# Altium schematic sheet Schematic原理图.schdoc
size 322 x 216 mm
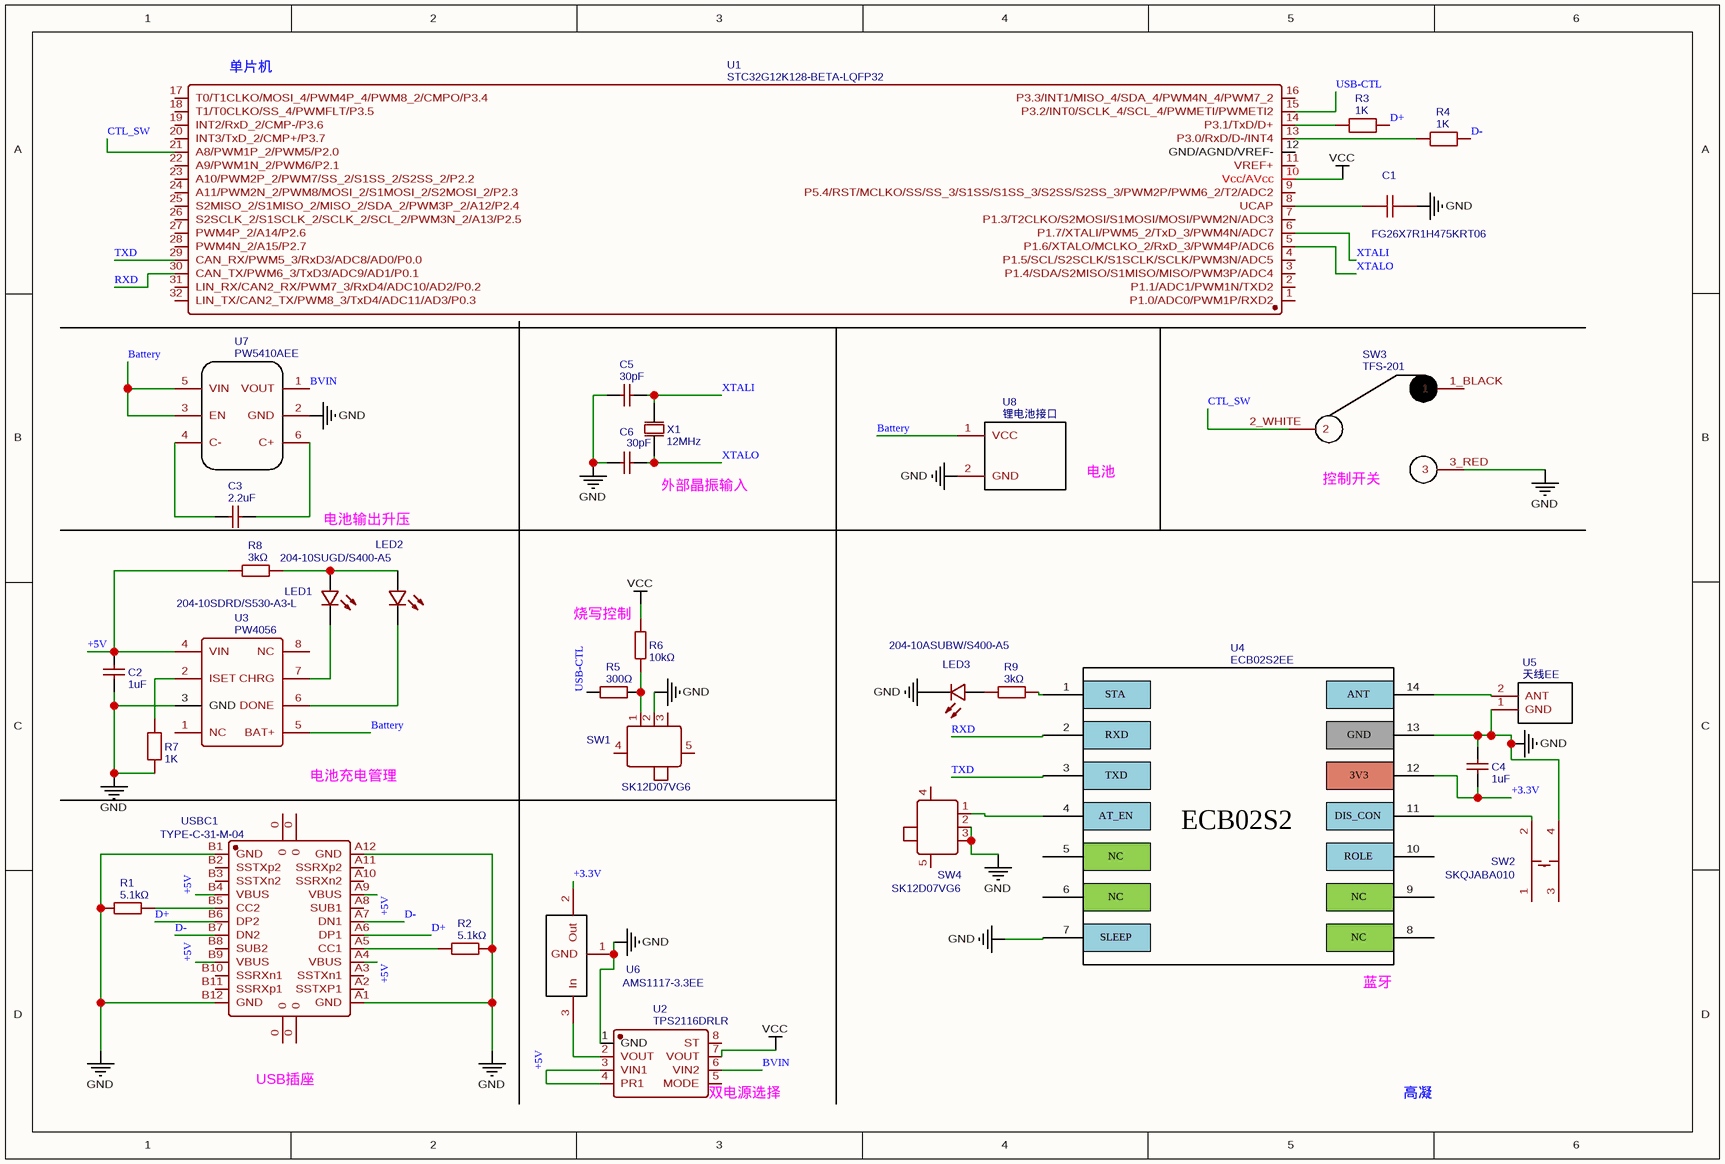
[diagram p0: Schematic原理图.schdoc]

## Parts
C1  FG26X7R1H475KRT06  [CAP-TH_L5.5-W3.5-P5.00-D0.5]
C2  1uF  [CAP-TH_L8.5-W5.0-P5.00-D1.2]
C3  2.2uF  [CAP-TH_L5.0-W2.5-P5.08-D0.7]
C4  1uF  [CAP-TH_L8.5-W5.0-P5.00-D1.2]
C5  30pF  [CAP-TH_L5.0-W2.5-P5.08-D0.7]
C6  30pF  [CAP-TH_L5.0-W2.5-P5.08-D0.7]
LED1  204-10SDRD/S530-A3-L  [LED-TH_BD3.8-P2.54-FD]
LED2  204-10SUGD/S400-A5  [LED-TH_BD3.0-P2.54-FD]
LED3  204-10ASUBW/S400-A5  [LED-TH_BD3.0-P2.54-FD]
R1  5.1kΩ  [RES-TH_BD2.2-L6.5-P10.50-D0.9]
R2  5.1kΩ  [RES-TH_BD2.2-L6.5-P10.50-D0.9]
R3  1K  [RES-TH_BD2.5-L6.5-P10.50-D0.6]
R4  1K  [RES-TH_BD2.5-L6.5-P10.50-D0.6]
R5  300Ω  [RES-TH_BD2.2-L6.5-P10.50-D0.6]
R6  10kΩ  [RES-TH_BD4.5-L11.0-P15.00-D0.7]
R7  1K  [RES-TH_BD2.5-L6.5-P10.50-D0.6]
R8  3kΩ  [RES-TH_BD2.2-L6.5-P10.50-D0.9]
R9  3kΩ  [RES-TH_BD2.2-L6.5-P10.50-D0.9]
SW1  SK12D07VG6  [SW-TH_SK12D07VG6]
SW2  SKQJABA010  [KEY-TH_4P-L6.2-W6.2-P4.50-LS6.5]
SW3  TFS-201  [TFS-201]
SW4  SK12D07VG6  [SW-TH_SK12D07VG6]
U1  STC32G12K128-BETA-LQFP32  [LQFP-32_L7.0-W7.0-P0.80-LS9.0-BL]
U2  TPS2116DRLR  [SOT-583-8_L2.1-W1.6-P0.50-LS1.6-BL]
U3  PW4056  [ESOP-8_L4.9-W3.9-P1.27-LS6.0-BL-EP2.6]
U4  ECB02S2EE  [ECB02S2]
U5  天线EE  [蓝牙天线]
U6  AMS1117-3.3EE  [AMS1117-SMALL]
U7  PW5410AEE  [PW5410A]
U8  锂电池接口  [电池接口]
USBC1  TYPE-C-31-M-04  [USB-C-SMD_TYPE-C-USB-20]
X1  12MHz  [HC-49US_L11.5-W4.5-P4.88]

## Nets
GND: C1.2 C2.1 C4.2 C5.1 C6.2 LED3.2(K) R1.1 R2.2 R7.1 SW1.2 SW2.4 SW3.3_RED(3) SW4.2 SW4.3 U2.1(GND) U3.3(GND) U4.7 U4.13 U5.1(GND) U6.1(GND) U7.2(GND) U8.2(GND) USBC1.A1(GND) USBC1.A12(GND) USBC1.B1(GND) USBC1.B12(GND)
VCC: R6.2 U1.10(Vcc/AVcc) U2.7(VOUT)
+3.3V: C4.1 U4.12 U6.2(Out)
+5V: C2.2 R8.1 U2.3(VIN1) U2.4(PR1) U3.4(VIN) USBC1.A4(VBUS) USBC1.A9(VBUS) USBC1.B4(VBUS) USBC1.B9(VBUS)
Battery: U3.5(BAT+) U7.3(EN) U7.5(VIN) U8.1(VCC)
BVIN: U2.6(VIN2) U7.1(VOUT)
CTL_SW: SW3.2_WHITE(2) U1.21(A8/PWM1P_2/PWM5/P2.0)
D+: R3.1 USBC1.A6(DP1) USBC1.B6(DP2)
D-: R4.1 USBC1.A7(DN1) USBC1.B7(DN2)
RXD: U1.30(CAN_TX/PWM6_3/TxD3/ADC9/AD1/P0.1) U4.2
TXD: U1.29(CAN_RX/PWM5_3/RxD3/ADC8/AD0/P0.0) U4.3
USB-CTL: R5.1 U1.15(P3.2/INT0/SCLK_4/SCL_4/PWMETI/PWMETI2)
XTALI: C5.2 U1.6(P1.7/XTALI/PWM5_2/TxD_3/PWM4N/ADC7) X1.2(OSC2)
XTALO: C6.1 U1.5(P1.6/XTALO/MCLKO_2/RxD_3/PWM4P/ADC6) X1.1(OSC1)
NetC1_1: C1.1 U1.8(UCAP)
NetC3_1: C3.1 U7.4(C-)
NetC3_2: C3.2 U7.6(C+)
NetLED1_1: LED1.1(A) LED2.1(A) R8.2
NetLED1_2: LED1.2(C) U3.7(CHRG)
NetLED2_2: LED2.2(K) U3.6(DONE)
NetLED3_1: LED3.1(A) R9.1
NetR1_2: R1.2 USBC1.B5(CC2)
NetR2_1: R2.1 USBC1.A5(CC1)
NetR3_2: R3.2 U1.14(P3.1/TxD/D+)
NetR4_2: R4.2 U1.13(P3.0/RxD/D-/INT4)
NetR5_2: R5.2 R6.1 SW1.1
NetR7_2: R7.2 U3.2(ISET)
NetR9_2: R9.2 U4.1
NetSW2_2: SW2.2 U4.11
NetSW4_1: SW4.1 U4.4
NetU2_2: U2.2(VOUT) U6.3(In)
NetU4_14: U4.14 U5.2(ANT)

Not connected (* = marked no-connect by the designer): SW1 3 4 5; SW2 1 3; SW3 1_BLACK(1); SW4 4 5; U1 1(P1.0/ADC0/PWM1P/RXD2) 2(P1.1/ADC1/PWM1N/TXD2) 3(P1.4/SDA/S2MISO/S1MISO/MISO/PWM3P/ADC4) 4(P1.5/SCL/S2SCLK/S1SCLK/SCLK/PWM3N/ADC5) 7(P1.3/T2CLKO/S2MOSI/S1MOSI/MOSI/PWM2N/ADC3) 9(P5.4/RST/MCLKO/SS/SS_3/S1SS/S1SS_3/S2SS/S2SS_3/PWM2P/PWM6_2/T2/ADC2) 11(VREF+) 12(GND/AGND/VREF-) 16(P3.3/INT1/MISO_4/SDA_4/PWM4N_4/PWM7_2) 17(T0/T1CLKO/MOSI_4/PWM4P_4/PWM8_2/CMPO/P3.4) 18(T1/T0CLKO/SS_4/PWMFLT/P3.5) 19(INT2/RxD_2/CMP-/P3.6) 20(INT3/TxD_2/CMP+/P3.7) 22(A9/PWM1N_2/PWM6/P2.1) 23(A10/PWM2P_2/PWM7/SS_2/S1SS_2/S2SS_2/P2.2) 24(A11/PWM2N_2/PWM8/MOSI_2/S1MOSI_2/S2MOSI_2/P2.3) 25(S2MISO_2/S1MISO_2/MISO_2/SDA_2/PWM3P_2/A12/P2.4) 26(S2SCLK_2/S1SCLK_2/SCLK_2/SCL_2/PWM3N_2/A13/P2.5) 27(PWM4P_2/A14/P2.6) 28(PWM4N_2/A15/P2.7) 31(LIN_RX/CAN2_RX/PWM7_3/RxD4/ADC10/AD2/P0.2) 32(LIN_TX/CAN2_TX/PWM8_3/TxD4/ADC11/AD3/P0.3); U2 5(MODE) 8(ST); U3 1(NC) 8(NC); U4 5 6 8 9 10; USBC1 0 A2(SSTXP1) A3(SSTXn1) A8(SUB1) A10(SSRXn2) A11(SSRXp2) B2(SSTXp2) B3(SSTXn2) B8(SUB2) B10(SSRXn1) B11(SSRXp1)

## Notes on the sheet
- (near U1) 单片机
- 外部晶振输入
- 电池
- (near SW3) 控制开关
- 电池输出升压
- (near R6) 烧写控制
- 电池充电管理
- (near U4) 蓝牙
- USB插座
- (near U2) 双电源选择
- 高凝
- (in symbol ECB02S2EE) STA; ANT; RXD; GND; TXD; 3V3; AT_EN; DIS_CON; NC; ROLE; SLEEP

## Library data of the parts
C1 = FG26X7R1H475KRT06: BOM_Manufacturer: TDK; Contributor: LCSC; Capacitance: 4.7uF; BOM_Supplier: LCSC; BOM_Supplier Part: C1620752; BOM_Manufacturer Part: FG26X7R1H475KRT06; BOM_JLCPCB Part Class: Extended Part; spicePre: C; spiceSymbolName: FG26X7R1H475KRT06
C2 C4 = 1uF: BOM_Manufacturer: FH(风华); BOM_Manufacturer Part: CT4-0805B105K500F3; nameAlias: Capacitance; Contributor: LCSC; BOM_Supplier: LCSC; BOM_Supplier Part: C94708; BOM_JLCPCB Part Class: Extended Part; spicePre: C; spiceSymbolName: CT4-0805B105K500F3
C3 = 2.2uF: BOM_Manufacturer: Dersonic(德尔创); BOM_Manufacturer Part: CD1E225KC9BER1E000; nameAlias: Capacitance; Contributor: LCSC; BOM_Supplier: LCSC; BOM_Supplier Part: C263178; BOM_JLCPCB Part Class: Extended Part; spicePre: C; spiceSymbolName: CD1E225KC9BER1E000
C5 C6 = 30pF: BOM_Manufacturer: Dersonic(德尔创); BOM_Manufacturer Part: CD1H300JC94ECHD000; nameAlias: Capacitance; Contributor: LCSC; BOM_Supplier: LCSC; BOM_Supplier Part: C263194; BOM_JLCPCB Part Class: Extended Part; spicePre: C; spiceSymbolName: CD1H300JC94ECHD000
LED1 = 204-10SDRD/S530-A3-L: BOM_Manufacturer: EVERLIGHT(亿光); BOM_Supplier: LCSC; BOM_Manufacturer Part: 204-10SDRD/S530-A3-L; BOM_Supplier Part: C84774; BOM_JLCPCB Part Class: Extended Part; spicePre: L; spiceSymbolName: 204-10SDRD/S530-A3-L
LED2 = 204-10SUGD/S400-A5: BOM_Manufacturer: EVERLIGHT(亿光); BOM_Supplier: LCSC; BOM_Manufacturer Part: 204-10SUGD/S400-A5; BOM_Supplier Part: C99761; BOM_JLCPCB Part Class: Extended Part; spicePre: L; spiceSymbolName: 204-10SUGD/S400-A5
LED3 = 204-10ASUBW/S400-A5: BOM_Manufacturer: EVERLIGHT(亿光); BOM_Supplier: LCSC; BOM_Manufacturer Part: 204-10ASUBW/S400-A5; BOM_Supplier Part: C97696; BOM_JLCPCB Part Class: Extended Part; spicePre: L; spiceSymbolName: 204-10ASUBW/S400-A5
R1 R2 = 5.1kΩ: BOM_Manufacturer: CCO(千志电子); BOM_Manufacturer Part: CF1/6W-5.1KΩ±5% T; Resistance (Ohms): 5.1K; nameAlias: Resistance; Contributor: LCSC; BOM_Supplier: LCSC; BOM_Supplier Part: C119887; BOM_JLCPCB Part Class: Extended Part; spicePre: R; spiceSymbolName: CF1/6W-5.1KΩ±5% T52
R3 R4 R7 = 1K: BOM_Manufacturer: VISHAY(威世); BOM_Manufacturer Part: MRS25000C1001FCT00; Contributor: lcsc; BOM_Supplier: LCSC; BOM_Supplier Part: C2979794; link: https://atta.szlcsc.com/upload/public/pdf/source/20220321/A2B584D72D714885B1D1519FBDD7E440.pdf; spicePre: U; spiceSymbolName: MRS25000C1001FCT00
R5 = 300Ω: BOM_Manufacturer: UNI-ROYAL(厚声); BOM_Manufacturer Part: MFR0W4F3000A50; nameAlias: Resistance; Resistance (Ohms): 300; BOM_Supplier: LCSC; BOM_Supplier Part: C58609; BOM_JLCPCB Part Class: Extended Part; spicePre: R; spiceSymbolName: MFR0W4F3000A50
R6 = 10kΩ: BOM_Manufacturer: VO(翔胜); BOM_Manufacturer Part: MO2WS-10K±5%-6T63; Contributor: lcsc; nameAlias: Resistance; BOM_Supplier: LCSC; BOM_Supplier Part: C2843070; link: https://atta.szlcsc.com/upload/public/pdf/source/20200622/C479426_3144C92B6E787A18688D073F1B971656.pdf; spicePre: U; spiceSymbolName: MO2WS-10K±5%-6T63
R8 R9 = 3kΩ: BOM_Manufacturer: CCO(千志电子); BOM_Manufacturer Part: CF1/6W-3KΩ±5% T; Resistance (Ohms): 3K; nameAlias: Resistance; Contributor: LCSC; BOM_Supplier: LCSC; BOM_Supplier Part: C119881; BOM_JLCPCB Part Class: Extended Part; spicePre: R; spiceSymbolName: CF1/6W-3KΩ±5% T52
SW1 SW4 = SK12D07VG6: BOM_Manufacturer: SHOU HAN(首韩); Contributor: LCSC; BOM_Supplier: LCSC; BOM_Supplier Part: C2681575; BOM_Manufacturer Part: SK12D07VG6; BOM_JLCPCB Part Class: Extended Part; spicePre: S; spiceSymbolName: SK12D07VG6
SW2 = SKQJABA010: BOM_Manufacturer: ALPSALPINE(阿尔卑斯阿尔派); Contributor: LCSC; BOM_Supplier: LCSC; BOM_Manufacturer Part: SKQJABA010; BOM_Supplier Part: C125037; BOM_JLCPCB Part Class: Extended Part; spicePre: S; spiceSymbolName: SKQJABA010
SW3 = TFS-201: Contributor: watcem; BOM_Supplier: LIXIANG; spicePre: S; spiceSymbolName: TFS-201
U1 = STC32G12K128-BETA-LQFP32: BOM_Manufacturer: STC(宏晶); Contributor: lcsc; BOM_Supplier: LCSC; BOM_Supplier Part: C3020369; BOM_Manufacturer Part: STC32G12K128-Beta-LQFP32; link: https://atta.szlcsc.com/upload/public/pdf/source/20220519/F36B7AE14E7682CFD7D7CC400D8CC62F.pdf; BOM_JLCPCB Part Class: Extended Part; spicePre: U; spiceSymbolName: STC32G12K128-BETA-LQFP32
U2 = TPS2116DRLR: BOM_Manufacturer: TI(德州仪器); Contributor: lcsc; BOM_Supplier: LCSC; BOM_Supplier Part: C3235557; BOM_Manufacturer Part: TPS2116DRLR; link: https://atta.szlcsc.comnull; spicePre: U; spiceSymbolName: TPS2116DRLR
U3 = PW4056: Contributor: Poyzb; spicePre: U; spiceSymbolName: PW4056
U4 = ECB02S2EE: Contributor: fenghongchang; spicePre: U; spiceSymbolName: ECB02S2
U5 = 天线EE: Contributor: pofeiren; spicePre: U; spiceSymbolName: 天线
U6 = AMS1117-3.3EE: BOM_Manufacturer: AMS; sourceId: dwIGgezVh; Contributor: whg1998; timeStamp: 1476261164; BOM_Supplier Part: C6186; BOM_Supplier: LCSC; BOM_Manufacturer Part: AMS1117-3.3; BOM_LCSC Assembly: Yes; spicePre: U; spiceSymbolName: AMS1117-3.3
U7 = PW5410AEE: Contributor: yao_yuan; spicePre: U; spiceSymbolName: PW5410A
U8 = 锂电池接口: Contributor: watcem; spicePre: U; spiceSymbolName: 锂电池接口
USBC1 = TYPE-C-31-M-04: BOM_Manufacturer: 韩国韩荣; Contributor: LCSC; BOM_Supplier: LCSC; BOM_Supplier Part: C129018; BOM_Manufacturer Part: TYPE-C-31-M-04; BOM_JLCPCB Part Class: Extended Part; spicePre: U; spiceSymbolName: TYPE-C-31-M-04
X1 = 12MHz: BOM_Manufacturer: YXC(扬兴晶振); BOM_Manufacturer Part: X49SD12MSD2SI; nameAlias: Frequency; Contributor: LCSC; BOM_Supplier: LCSC; BOM_Supplier Part: C114441; BOM_JLCPCB Part Class: Extended Part; spicePre: X; spiceSymbolName: X49SD12MSD2SI